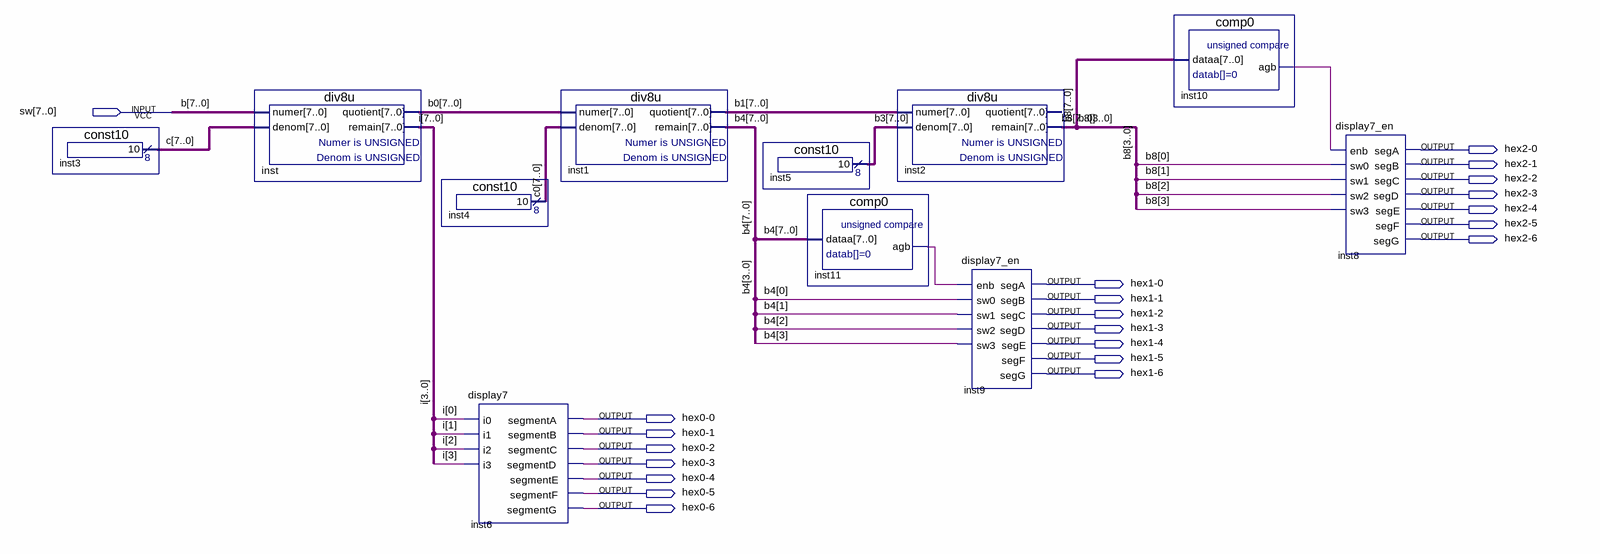
[diagram p0: schematic sheet]
// Quartus schematic display_8bits.bdf as structural Verilog: 11 symbols, 22 pins
module display_8bits (
  input  [7:0] sw,
  output \hex2-0 ,
  output \hex2-1 ,
  output \hex2-2 ,
  output \hex2-3 ,
  output \hex2-4 ,
  output \hex2-5 ,
  output \hex2-6 ,
  output \hex1-0 ,
  output \hex1-1 ,
  output \hex1-2 ,
  output \hex1-3 ,
  output \hex1-4 ,
  output \hex1-5 ,
  output \hex1-6 ,
  output \hex0-0 ,
  output \hex0-1 ,
  output \hex0-2 ,
  output \hex0-3 ,
  output \hex0-4 ,
  output \hex0-5 ,
  output \hex0-6 
);

  wire inst10_agb, inst11_agb;
  wire [7:0] b0, b1, b3, b4, b8, c, c0, i;

  const10 inst3 (.result(c));
  div8u inst (.numer(sw), .denom(c), .quotient(b0), .remain(i));
  const10 inst4 (.result(c0));
  display7 inst6 (
    .i0(i[0]), .i1(i[1]), .i2(i[2]), .i3(i[3]), .segmentA(\hex0-0 ), .segmentB(\hex0-1 ),
    .segmentC(\hex0-2 ), .segmentD(\hex0-3 ), .segmentE(\hex0-4 ), .segmentF(\hex0-5 ), .segmentG(\hex0-6 ));
  div8u inst1 (.numer(b0), .denom(c0), .quotient(b1), .remain(b4));
  const10 inst5 (.result(b3));
  comp0 inst11 (.dataa(b4), .agb(inst11_agb));
  div8u inst2 (.numer(b1), .denom(b3), .remain(b8));  // open: quotient
  display7_en inst9 (
    .enb(inst11_agb), .sw0(b4[0]), .sw1(b4[1]), .sw2(b4[2]), .sw3(b4[3]), .segA(\hex1-0 ), .segB(\hex1-1 ),
    .segC(\hex1-2 ), .segD(\hex1-3 ), .segE(\hex1-4 ), .segF(\hex1-5 ), .segG(\hex1-6 ));
  comp0 inst10 (.dataa(b8), .agb(inst10_agb));
  display7_en inst8 (
    .enb(inst10_agb), .sw0(b8[0]), .sw1(b8[1]), .sw2(b8[2]), .sw3(b8[3]), .segA(\hex2-0 ), .segB(\hex2-1 ),
    .segC(\hex2-2 ), .segD(\hex2-3 ), .segE(\hex2-4 ), .segF(\hex2-5 ), .segG(\hex2-6 ));

  // Other names for the same wires on the sheet: b[7:0] = sw
endmodule
